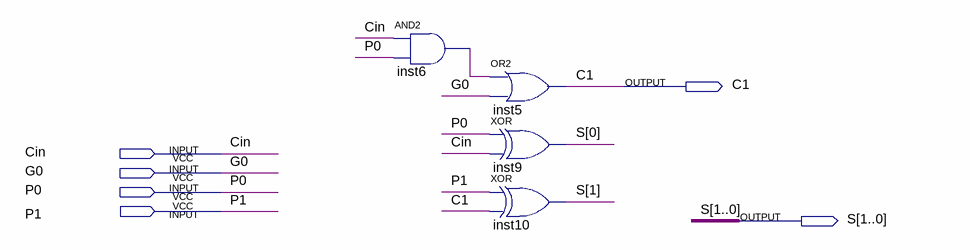
[diagram p0: schematic sheet]
// Quartus schematic COut2.bdf as structural Verilog: 4 symbols, 6 pins
module COut2 (
  input  Cin,
  input  G0,
  input  P0,
  input  P1,
  output C1,
  output [1:0] S
);

  wire inst6_out;

  and inst6 (inst6_out, Cin, P0);
  or inst5 (C1, inst6_out, G0);
  xor inst9 (S[0], P0, Cin);
  xor inst10 (S[1], P1, C1);
endmodule
